# Altium schematic sheet Power Supply.SchDoc: Power Supplies: 5V @ 5A; 3.3V @1A
size A; Engineer: H Potential; DocumentNumber: 5; Revision: 3.4; SheetNumber: 5; SheetTotal: 5
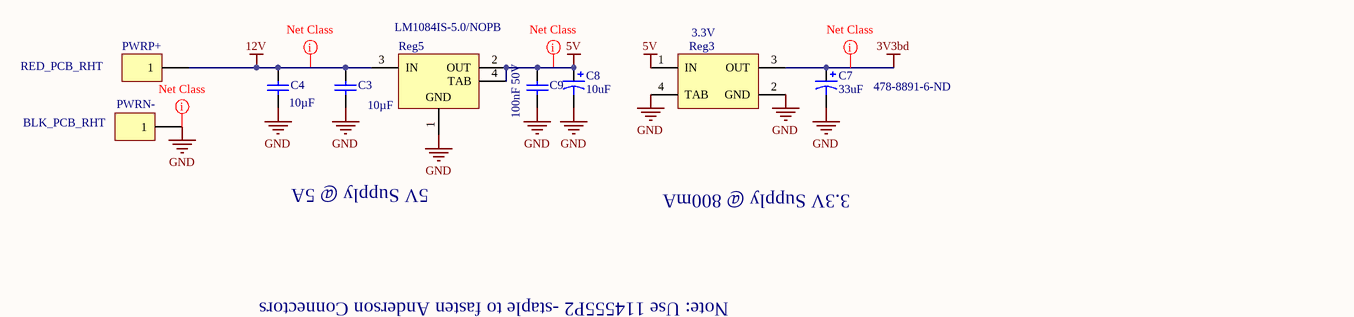
[diagram p0: Power Supply.SchDoc]

## Parts
C3  10µF  [CAPC2013X135X45ML10T25]
C4  10µF  [CAPC2013X135X45ML10T25]
C7  33uF  Supplier Part Number 1: 478-8891-6-ND  [AVX-CAPC3528_V]
C8  10uF  [AVX-CAPC3528_V]
C9  100nF 50V  [0603C_L]
PWRN-  BLK_PCB_RHT  [Anderson_BLK_RHT_BOT]
PWRP+  RED_PCB_RHT  [Anderson_Red_RHT_BOT]
Reg3  3.3V  [DCY0004A_M]
Reg5  LM1084IS-5.0/NOPB  [KTT0003B_L]

## Nets
3V3bd: C7.1 Reg3.3(OUT)
5V: C8.1 C9.2 Reg3.1(IN) Reg5.2(OUT) Reg5.4(TAB)
12V: C3.2 C4.2 PWRP+.1 Reg5.3(IN)
GND: C3.1 C4.1 C7.2 C8.2 C9.1 PWRN-.1 Reg3.2(GND) Reg3.4(TAB) Reg5.1(GND)

## Layout directives
net class PowerNets: 3V3bd, 5V, 12V, GND

## Notes on the sheet
- 5V Supply @ 5A
- 3.3V Supply @ 800mA
- Note: Use 114555P2 -staple to fasten Anderson Connectors
- Title
- Size:
- Date:
- A
- Project:
- Time:
- Revision:
- Sheet
- of
- Engineer:
- File:

## Library data of the parts
C3 C4 = CMP-2007-03541-1: Part Number: GRM21BR61E106KA73L; Manufacturer: Murata; Product Training Modules: High-Cap Multilayer Ceramic Capacitors; Catalog Drawings: GRM Series_0805_1.25; Tolerance: ±10%; Voltage - Rated: 25V; Temperature Coefficient: X5R; Online Catalog: GRM Series; Other Names: 490-5523-6; Supplier 1: Digikey; Supplier Part Number 1: 490-5523-1-ND; Manufacturer Part Number: GRM21BR61E106KA73L; Stock 1: 750766; Pricing 1: 1=0.19, 10=0.13, 50=0.0748, 100=0.0618, 250=0.052, 500=0.0436, 1000=0.0358 (USD); Standard Package: 1; Category: Capacitors; Family: Ceramic Capacitors; Series: GRM; Packaging: Digi-Reel®; Capacitance: 10µF; Mounting Type: Surface Mount, MLCC; Operating Temperature: -55°C ~ 85°C; Applications: General Purpose; Ratings: -; Package / Case: 0805 (2012 Metric); Size / Dimension: 0.079" L x 0.049" W (2.00mm x 1.25mm); Height - Seated (Max): -; Thickness (Max): 0.053" (1.35mm); Lead Spacing: -; Features: -; Lead Style: -; ComponentLink1URL: https://datasheet.ciiva.com/139/partnumbering-e-01-139184.pdf; ComponentLink1Description: https://datasheet.ciiva.com/139/partnumbering-e-01-139184.pdf; ComponentLink2URL: https://datasheet.ciiva.com/28584/626718-28584288.pdf; ComponentLink2Description: https://datasheet.ciiva.com/28584/626718-28584288.pdf; ComponentLink3URL: https://datasheet.ciiva.com/16440/grm21br61e106ka73l-16440627.pdf; ComponentLink3Description: https://datasheet.ciiva.com/16440/grm21br61e106ka73l-16440627.pdf; ComponentLink4URL: https://datasheet.ciiva.com/7719/1747469-7719093.pdf; ComponentLink4Description: https://datasheet.ciiva.com/7719/1747469-7719093.pdf; ComponentLink5URL: https://datasheet.ciiva.com/5424/product-5424327.pdf; ComponentLink5Description: https://datasheet.ciiva.com/5424/product-5424327.pdf; ComponentLink6URL: https://datasheet.ciiva.com/28584/626718-28584279.pdf; ComponentLink6Description: https://datasheet.ciiva.com/28584/626718-28584279.pdf; ComponentLink7URL: https://datasheet.ciiva.com/14116/grmseries-highdielectrictype-eng-14116376.pdf; ComponentLink7Description: https://datasheet.ciiva.com/14116/grmseries-highdielectrictype-eng-14116376.pdf; ComponentLink8URL: https://datasheet.ciiva.com/22774/1747469-22774396.pdf; ComponentLink8Description: https://datasheet.ciiva.com/22774/1747469-22774396.pdf; ComponentLink9URL: https://datasheet.ciiva.com/139/partnumbering-e-01-139182.pdf; ComponentLink9Description: https://datasheet.ciiva.com/139/partnumbering-e-01-139182.pdf; ComponentLink10URL: https://datasheet.ciiva.com/139/partnumbering-e-01-139183.pdf; ComponentLink10Description: https://datasheet.ciiva.com/139/partnumbering-e-01-139183.pdf; ComponentLink11URL: https://datasheet.ciiva.com/29199/454623-da-01-en-vs-kondensator-0805-29199615.pdf; ComponentLink11Description: https://datasheet.ciiva.com/29199/454623-da-01-en-vs-kondensator-0805-29199615.pdf
C7 = CMP-0279-00001-1: Capacitor, Tantalum, 10uF 10% 20V MCCT-B (3528); Manufacturer: Kyocera / AVX; Manufacturer Part Number: TAJB336K006RNJ; PCN Part Number: TAJ Series Suffix 08/Dec/2008; Manufacturer Size Code: B; Product Training Modules: Component Solutions for Smart Meter Applications; Catalog Drawings: TAJ Series Side / TAJ Series; Voltage - Rated: 6.3V; Type: Molded; Dynamic Catalog: TAJ Series; Other Names: 478-8891-6; Capacitance: 33uF; Supplier 1: Digikey; Stock 1: 0; Pricing 1: 1=0.67, 10=0.476, 25=0.4064, 50=0.36, 100=0.3136, 250=0.2671, 500=0.2323, 1000=0.1974 (USD); Failure Rate: General Purpose; Standard Package: 1; Category: Capacitors; Family: Tantalum Capacitors; Series: TAJ; Packaging: Digi-Reel®; Tolerance: ±10%; ESR (Equivalent Series Resistance): -; Operating Temperature: -55°C ~ 125°C; Mounting Type: Surface Mount; Package / Case: 1210 (3528 Metric); Size / Dimension: 0.138" L x 0.110" W (3.50mm x 2.80mm); Height - Seated (Max): 0.083" (2.10mm); Lead Spacing: -; Features: General Purpose; Lifetime @ Temp.: -; ComponentLink1URL: https://datasheet.ciiva.com/11793/0900766b80ccdc61-11793299.pdf; ComponentLink1Description: https://datasheet.ciiva.com/11793/0900766b80ccdc61-11793299.pdf; ComponentLink2URL: https://datasheet.ciiva.com/7775/1680476-7775701.pdf; ComponentLink2Description: https://datasheet.ciiva.com/7775/1680476-7775701.pdf; ComponentLink3URL: https://datasheet.ciiva.com/7775/1680476-7775702.pdf; ComponentLink3Description: https://datasheet.ciiva.com/7775/1680476-7775702.pdf; ComponentLink4URL: https://datasheet.ciiva.com/7775/1680476-7775703.pdf; ComponentLink4Description: https://datasheet.ciiva.com/7775/1680476-7775703.pdf; ComponentLink5URL: https://datasheet.ciiva.com/28516/taj-28516106.pdf; ComponentLink5Description: https://datasheet.ciiva.com/28516/taj-28516106.pdf; ComponentLink6URL: https://datasheet.ciiva.com/12884/taj-27497-12884571.pdf; ComponentLink6Description: https://datasheet.ciiva.com/12884/taj-27497-12884571.pdf; ComponentLink7URL: https://datasheet.ciiva.com/29504/taj-29504347.pdf; ComponentLink7Description: https://datasheet.ciiva.com/29504/taj-29504347.pdf; ComponentLink8URL: https://datasheet.ciiva.com/29504/taj-29504348.pdf; ComponentLink8Description: https://datasheet.ciiva.com/29504/taj-29504348.pdf; ComponentLink9URL: https://datasheet.ciiva.com/29504/taj-29504349.pdf; ComponentLink9Description: https://datasheet.ciiva.com/29504/taj-29504349.pdf; ComponentLink10URL: https://datasheet.ciiva.com/16492/taj-16492862.pdf; ComponentLink10Description: https://datasheet.ciiva.com/16492/taj-16492862.pdf
C8 = CMP-0279-00001-1: Capacitor, Tantalum, 10uF 10% 20V MCCT-B (3528); PartNumber: TAJB106K020R; Manufacturer: AVX; Manufacturer Part Number: TAJB106K020RNJ; Polarity: Polarized; Case Style: Molded; DCL: 2 uA; DF: 6%; ESR: 2.1 ohm; Insulation: Not Required; Lead Spacing (nom): Not Required mm; Product Depth (mm): 2.8 mm; Product Height (mm): 1.9 mm; Product Length (mm): 3.5 mm; Rad Hardened: No; Voltage: 20VDC; PackageDescription: 2-Pin SMT Capacitor, 3.5 x 2.8 mm Body; ComponentLink1URL: http://www.avx.com/; PackageReference: CAPC3528; ComponentLink2Description: Datasheet; Capacitance: 10uF; Technology: Tantalum; ComponentLink2URL: http://www.avx.com/docs/Catalogs/taj.pdf; Tolerance: 10%; ComponentLink1Description: Manufacturer URL; Rated Voltage: 20V; DatasheetVersion: Jun-13; Mounting Technology: Surface Mount; Supplier 1: Digikey; Supplier Part Number 1: 478-1674-6-ND; Stock 1: 65037; Pricing 1: 1=0.65, 10=0.459, 25=0.392, 50=0.3472, 100=0.3024, 250=0.2576, 500=0.224, 1000=0.1904 (USD); Case Code: B; Construction: SMT Chip; Failure Rate: Not Required; Length W/Weld: Not Required mm; Length W/Weld (max): Not Required mm; Mounting Style: Surface Mount; Operating Temp Range: -55C to 125C; Package / Case: 3528-21; Packaging: Tape and Reel; Product Diameter (mm): Not Required mm; Seal: Not Required; Seated Plane Height: Not Required mm; Tolerance (+ or -): 10%; Wire Form: Not Required; ComponentLink3URL: https://datasheet.ciiva.com/11793/0900766b80ccdc61-11793072.pdf; ComponentLink3Description: https://datasheet.ciiva.com/11793/0900766b80ccdc61-11793072.pdf; ComponentLink4URL: https://datasheet.ciiva.com/14586/70001050-14586940.pdf; ComponentLink4Description: https://datasheet.ciiva.com/14586/70001050-14586940.pdf; ComponentLink5URL: https://datasheet.ciiva.com/16485/taj-16485899.pdf; ComponentLink5Description: https://datasheet.ciiva.com/16485/taj-16485899.pdf; ComponentLink6URL: https://datasheet.ciiva.com/5936/13070-5936843.pdf; ComponentLink6Description: https://datasheet.ciiva.com/5936/13070-5936843.pdf; ComponentLink7URL: https://datasheet.ciiva.com/3004/taj-3004427.pdf; ComponentLink7Description: https://datasheet.ciiva.com/3004/taj-3004427.pdf; ComponentLink8URL: https://datasheet.ciiva.com/16393/taj-16393850.pdf; ComponentLink8Description: https://datasheet.ciiva.com/16393/taj-16393850.pdf; ComponentLink9URL: https://datasheet.ciiva.com/3004/taj-3004426.pdf; ComponentLink9Description: https://datasheet.ciiva.com/3004/taj-3004426.pdf; ComponentLink10URL: https://datasheet.ciiva.com/18710/taj-eng-18710633.pdf; ComponentLink10Description: https://datasheet.ciiva.com/18710/taj-eng-18710633.pdf; ComponentLink11URL: https://datasheet.ciiva.com/12882/taj-27497-12882702.pdf; ComponentLink11Description: https://datasheet.ciiva.com/12882/taj-27497-12882702.pdf; ComponentLink12URL: https://datasheet.ciiva.com/7730/1826076-7730729.pdf; ComponentLink12Description: https://datasheet.ciiva.com/7730/1826076-7730729.pdf; ComponentLink13URL: https://datasheet.ciiva.com/14602/70001050-14602487.pdf; ComponentLink13Description: https://datasheet.ciiva.com/14602/70001050-14602487.pdf; ComponentLink14URL: https://datasheet.ciiva.com/7730/1826076-7730727.pdf; ComponentLink14Description: https://datasheet.ciiva.com/7730/1826076-7730727.pdf; ComponentLink15URL: https://datasheet.ciiva.com/26341/559425-da-01-en-tacc-b-3-2-mm-x-2-5-mm-x-1-9-mm-10-uf-26341766.pdf; ComponentLink15Description: https://datasheet.ciiva.com/26341/559425-da-01-en-tacc-b-3-2-mm-x-2-5-mm-x-1-9-mm-10-uf-26341766.pdf; ComponentLink16URL: https://datasheet.ciiva.com/7730/1826076-7730726.pdf; ComponentLink16Description: https://datasheet.ciiva.com/7730/1826076-7730726.pdf; ComponentLink17URL: https://datasheet.ciiva.com/263/taj-263492.pdf; ComponentLink17Description: https://datasheet.ciiva.com/263/taj-263492.pdf; ComponentLink18URL: https://datasheet.ciiva.com/263/taj-263491.pdf; ComponentLink18Description: https://datasheet.ciiva.com/263/taj-263491.pdf; ComponentLink19URL: https://datasheet.ciiva.com/263/taj-263490.pdf; ComponentLink19Description: https://datasheet.ciiva.com/263/taj-263490.pdf; ComponentLink20URL: https://datasheet.ciiva.com/7730/1826076-7730728.pdf; ComponentLink20Description: https://datasheet.ciiva.com/7730/1826076-7730728.pdf; ComponentLink21URL: https://datasheet.ciiva.com/26787/tajb106k020rnj-26787086.pdf; ComponentLink21Description: https://datasheet.ciiva.com/26787/tajb106k020rnj-26787086.pdf
C9 = Cap100nF_50V_0603: Manufacturer: Yageo; Manufacturer Part Number: CC0603ZRY5V9BB104; Capacitance: 0.10µF; Tolerance: -20%, +80%; Temperature Coefficient: Y5V (F); Supplier 1: Digi-Key; Supplier Part Number 1: 311-1343-1-ND; RoHS: RoHS Compliant; Category: Capacitors; Stock 1: 1827128; Pricing 1: 1=0.1, 10=0.018, 25=0.0128, 100=0.0082, 250=0.00672, 500=0.00574, 1000=0.00447 (USD); Packaging: Cut Tape (CT); Part Status: Active; Voltage - Rated: 50V; Operating Temperature: -30°C ~ 85°C; Features: -; Ratings: -; Applications: General Purpose; Failure Rate: -; Mounting Type: Surface Mount, MLCC; Package / Case: 0603 (1608 Metric); Size / Dimension: 0.063" L x 0.031" W (1.60mm x 0.80mm); Height - Seated (Max): -; Thickness (Max): 0.035" (0.90mm); Lead Spacing: -; Lead Style: -; ComponentLink1URL: http://www.yageo.com/documents/recent/UPY-GPHC_Y5V_6.3V-to-50V_6.pdf; ComponentLink1Description: http://www.yageo.com/documents/recent/UPY-GPHC_Y5V_6.3V-to-50V_6.pdf
PWRN- = Anderson-1Pin BLK_PCB_RHT: 1 pin Anderson; Manufacturer: Anderson Power Products (APP); Manufacturer Part Number: 1377G1, 1377G2, 1327-BK,137G6-BK; Number of Positions / Contacts: 1; Voltage Rating: 600 V; Current Rating: 25 A; Mouser: 879-1327G6; Mouser: 879-1327; Mouser: 879-1377G2; Mouser: 879-1377G1; Supplier 1: Mouser; Stock 1: 233; Pricing 1: 1=1.14, 10=1.14, 50=0.947, 100=0.901, 1000=0.777, 10000=0.777 (USD); Termination Style: Solder; Series: PCB Powerpole; Product Type: Contacts; Contact Material: Copper Alloy; Contact Plating: Tin; ComponentLink1URL: http://components.arrow.com/part/dataview/0323_01933244; ComponentLink1Description: http://components.arrow.com/part/dataview/0323_01933244; ComponentLink2URL: http://www.andersonpower.com/files.php?file=CAT-PPMP(4).pdf; ComponentLink2Description: http://www.andersonpower.com/files.php?file=CAT-PPMP(4).pdf; Supplier Part Number 2: 879-1377G2; Supplier Part Number 1: 879-1377G1; Supplier Part Number 3: 879-1327G6; Supplier Part Number 4: 879-1327
PWRP+ = Anderson-1Pin RED_PCB_RHT: 1 pin Anderson; Manufacturer: Anderson Power Products (APP); Manufacturer Part Number: 1377G1, 1377G2, 1327-BK,137G6-BK; Number of Positions / Contacts: 1; Voltage Rating: 600 V; Current Rating: 25 A; Mouser: 879-1327G6; Mouser: 879-1327; Mouser: 879-1377G2; Mouser: 879-1377G1; Supplier 1: Mouser; Stock 1: 233; Pricing 1: 1=1.14, 10=1.14, 50=0.947, 100=0.901, 1000=0.777, 10000=0.777 (USD); Termination Style: Solder; Series: PCB Powerpole; Product Type: Contacts; Contact Material: Copper Alloy; Contact Plating: Tin; ComponentLink1URL: http://components.arrow.com/part/dataview/0323_01933244; ComponentLink1Description: http://components.arrow.com/part/dataview/0323_01933244; ComponentLink2URL: http://www.andersonpower.com/files.php?file=CAT-PPMP(4).pdf; ComponentLink2Description: http://www.andersonpower.com/files.php?file=CAT-PPMP(4).pdf; Supplier Part Number 2: 879-1377G2; Supplier Part Number 1: 879-1377G1; Supplier Part Number 3: 879-1327G6; Supplier Part Number 4: 879-1327
Reg3 = CMP-0062-01788-3: 1A Low Dropout Regulator for 5V to 3.3V Conversion, 4-pin SOT-223, Pb-Free; Manufacturer: Texas Instruments; Manufacturer Part Number: LM3940IMP-3.3/NOPB; PowerWise: N; CompType: LDO IC; PackageTopMarking: XYTT*L52B; Voltage Regulator Type: LDO; Regulator Output Type: Fixed; Polarity Type: Positive; Number of Outputs: 1; Input Voltage (Min): 4.5V; Input Voltage: 7.5V; Load Regulation: 50mV; Line Regulation: 40mV; Dropout Voltage@Current (Typ): 0.5@1A/0.11@100mA; Quiescent Current (Max): 15mA; PackageDescription: Molded SOT-223, 6.50 x 3.56 x 1.6mm Body, 4 Lead, 2.3mm Pitch; ComponentLink1URL: http://www.ti.com/general/docs/lit/getliterature.tsp?genericPartNumber=LM3940&fileType=pdf; PackageReference: DCY0004A; RoHS: Y; ComponentLink1Description: Datasheet URL; PinCount: 4; Code_JEDEC: TO-261-AA; Code_IPC: SOT223-4; Supplier 1: Digikey; Supplier Part Number 1: LM3940IMP-3.3/NOPBDKR-ND; Stock 1: 22816; Pricing 1: 1=1.49, 10=1.332, 100=1.0381, 500=0.8585 (USD); Topology: LDO; Output Voltage: 3.3V; Package Type: SOT-223; Packaging: Tape and Reel; Output Current: 1A; Operating Temp Range: -40C to 125C; Operating Temperature Classification: Automotive; Pin Count: 3 +Tab; Mounting: Surface Mount; ComponentLink2URL: https://datasheet.ciiva.com/48433/elnatsemico-spanungsregler-ldo-lm3940-en-48433415.pdf; ComponentLink2Description: https://datasheet.ciiva.com/48433/elnatsemico-spanungsregler-ldo-lm3940-en-48433415.pdf; ComponentLink3URL: https://datasheet.ciiva.com/49046/1896170-49046286.pdf; ComponentLink3Description: https://datasheet.ciiva.com/49046/1896170-49046286.pdf; ComponentLink4URL: https://datasheet.ciiva.com/46384/1882650-46384431.pdf; ComponentLink4Description: https://datasheet.ciiva.com/46384/1882650-46384431.pdf
Reg5 = CMP-0062-00575-4: 5A Low Dropout Positive Regulators, 3-pin TO-263, Pb-Free; Manufacturer: Texas Instruments; PowerWise: N; PackageTopMarking: NSUZXYTTE#*LM1084*IS-5.0; High-Reliability: Y; CompType: LDO IC; ComponentLink1Description: Datasheet URL; PackageDescription: TO-263, Molded, .400 x .390 x .180in, 3 Lead, .1in Pitch, Surface Mount; RoHS: Y; PackageReference: KTT0003B; PinCount: 3; Code_JEDEC: MO-169-AA; PartNumber: LM1084IS-5.0/NOPB; ComponentLink1URL: http://www.ti.com/general/docs/lit/getliterature.tsp?genericPartNumber=LM1084&fileType=pdf